# Altium schematic sheet Linear_1A_5V_Supply.SchDoc
size A
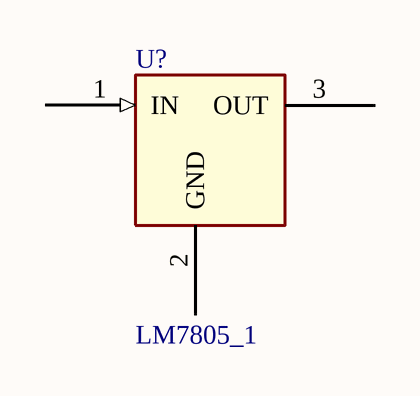
[diagram p0: Linear_1A_5V_Supply.SchDoc]

## Parts
U?  LM7805_1  [TO220]

## Nets

Not connected (* = marked no-connect by the designer): U? 1(IN) 2(GND) 3(OUT)

## Library data of the parts
U? = LM7805_1: IC REG LDO 5V 1A TO220-3; MPN: LM7805CT; PN: LM7805CT-ND; URL: http://www.digikey.ca/product-detail/en/LM7805CT/LM7805CT-ND